# EAGLE design hb100 (EAGLE 6.1)
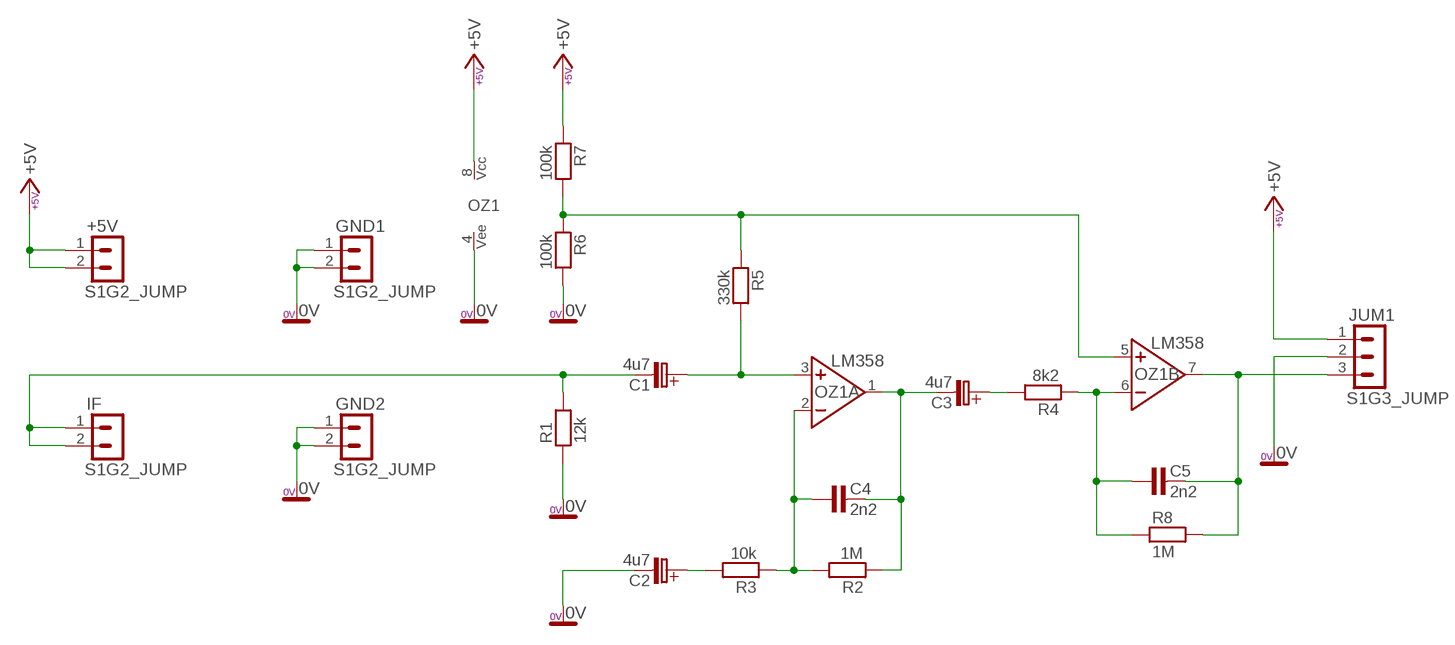
[diagram p0: schematic, sheet 1]

## Parts
+5V  S1G2_JUMP  [S1G2_JUM]
C1  4u7  C-ELEKTROLYT_3,5  [C-EL_3,5]
C2  4u7  C-ELEKTROLYT_3,5  [C-EL_3,5]
C3  4u7  C-ELEKTROLYT_3,5  [C-EL_3,5]
C4  2n2  C-KERAMIK_5  [C-5]
C5  2n2  C-KERAMIK_5  [C-5]
GND1  S1G2_JUMP  [S1G2_JUM]
GND2  S1G2_JUMP  [S1G2_JUM]
IF  S1G2_JUMP  [S1G2_JUM]
JUM1  S1G3_JUMP  [S1G3_JUM]
OZ1  LM358  [DIL8]
R1  12k  R_7,5  [R-7,5]
R2  1M  R_7,5  [R-7,5]
R3  10k  R_7,5  [R-7,5]
R4  8k2  R_7,5  [R-7,5]
R5  330k  R_7,5  [R-7,5]
R6  100k  R_7,5  [R-7,5]
R7  100k  R_7,5  [R-7,5]
R8  1M  R_7,5  [R-7,5]

## Nets
0V: C2.C-(C_EL-) GND1.1 GND1.2 GND2.1 GND2.2 JUM1.2 OZ1.4(NS:VEE) R1.1 R6.2
+5V: +5V.1 +5V.2 JUM1.1 OZ1.8(NS:VCC) R7.1
N$1: C1.C-(C_EL-) IF.1 IF.2 R1.2
N$2: C1.C+(C_EL+) OZ1.3(A:NEIN+) R5.2
N$3: C3.C+(C_EL+) R4.2
N$4: OZ1.5(B:NEIN+) R5.1 R6.1 R7.2
N$5: C3.C-(C_EL-) C4.2 OZ1.1(A:VYSTUP) R2.1
N$6: C5.1 OZ1.6(B:IN-) R4.1 R8.1
N$8: C2.C+(C_EL+) R3.2
N$9: C4.1 OZ1.2(A:IN-) R2.2 R3.1
N$10: C5.2 JUM1.3 OZ1.7(B:VYSTUP) R8.2

## Library data of the parts
+5V GND1 GND2 IF = #PaJa_konektory:S1G2_JUMP: Radove konektory - koliky - 2x
C1-C3 = #PaJa_30:C-ELEKTROLYT: Kondenzator - elektrolyticky
C4 C5 = #PaJa_30:C-KERAMIK: Kondenzator - keramicky
JUM1 = #PaJa_konektory:S1G3_JUMP: Radove konektory - koliky - 3x
OZ1 = #PaJa_30:LM358: OZ - 2x - nizkoprikonovy
R1-R8 = #PaJa_30:R: Rezistor

## Board
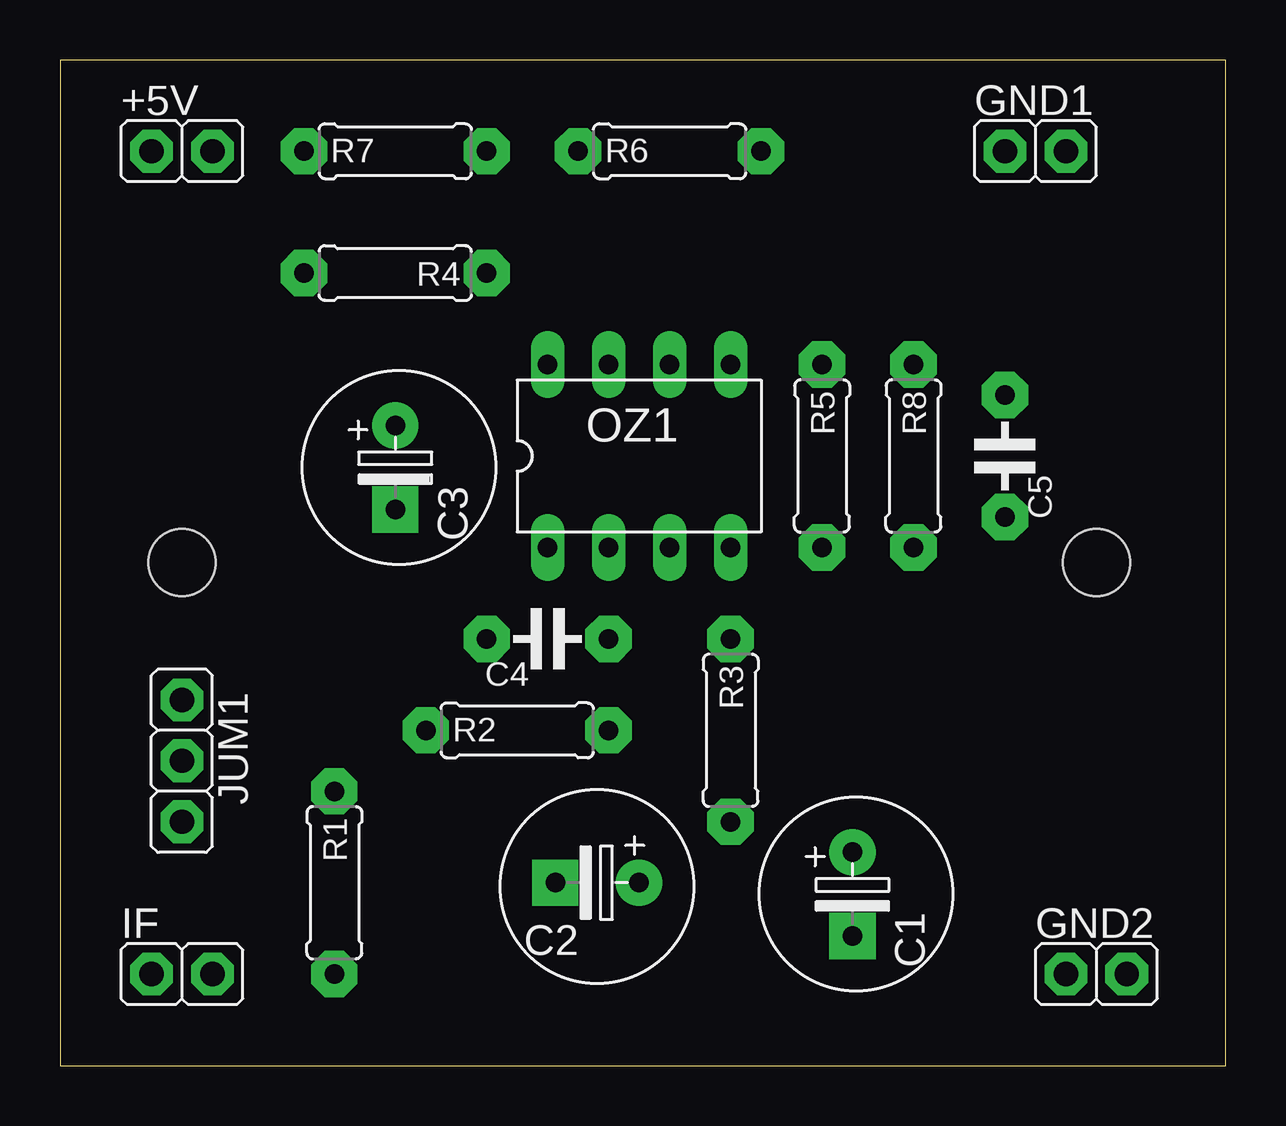
[diagram p1: board, top side]
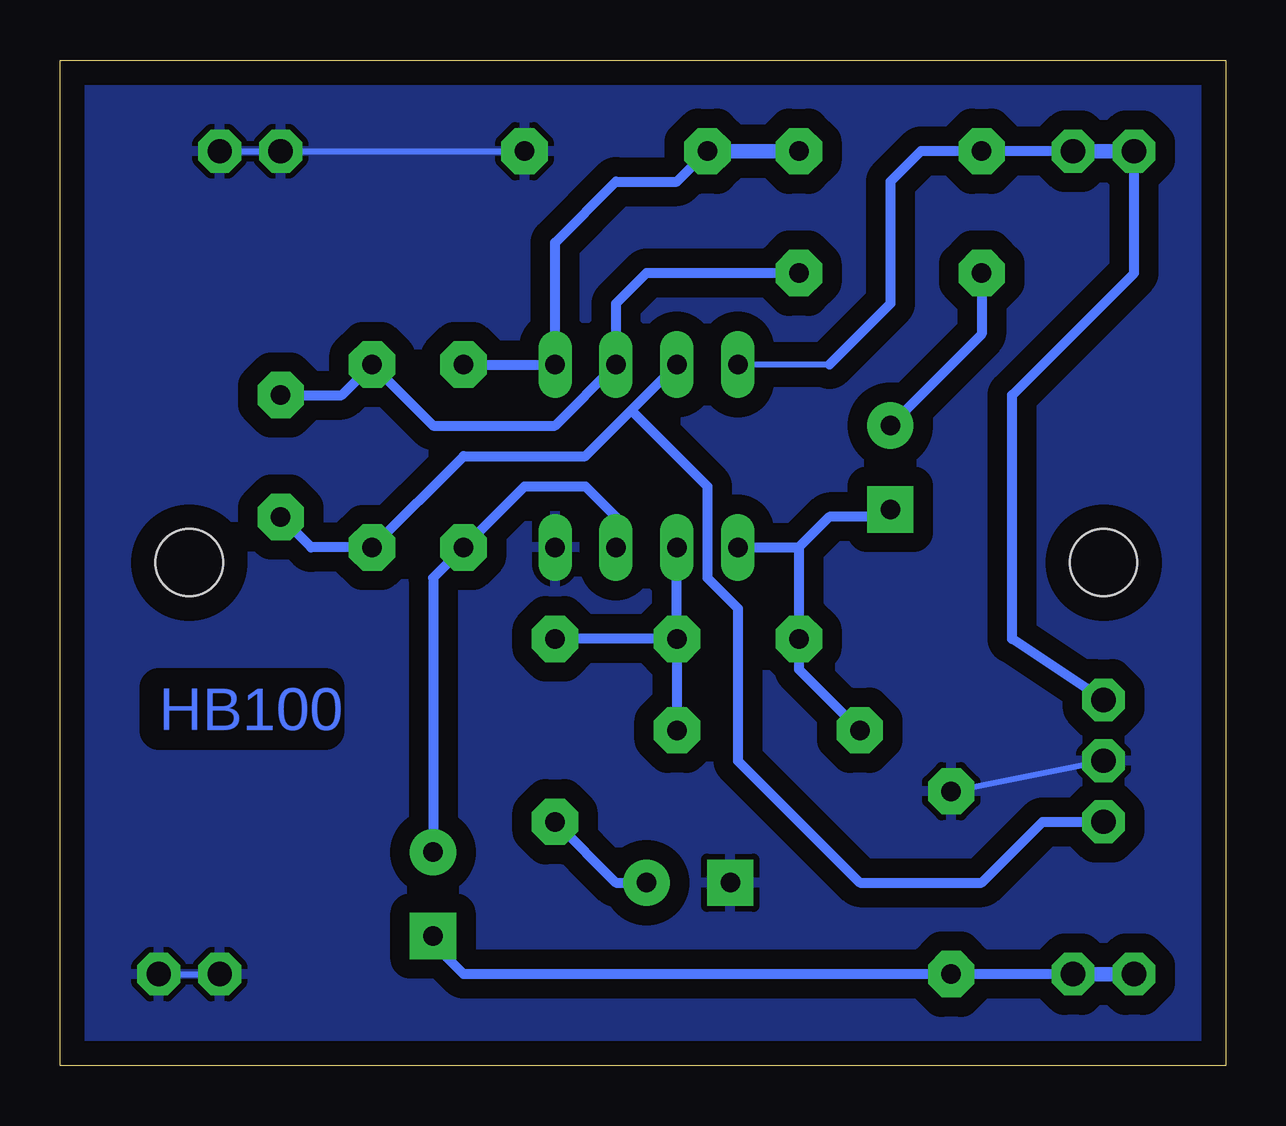
[diagram p2: board, bottom side, seen from below]

Size 48.57 x 41.9 mm. Coordinates in mm from the lower left corner, seen from the top.
Outline: 0,0 48.57,0 48.57,41.9 0,41.9 0,0
Copper layers (1*16): Top 0.035mm / dielectric 1.5mm / Bottom 0.035mm
Design rules: minimum track width 10mil, minimum drill 24mil, track to track 8mil, track to pad 8mil, pad to pad 8mil, via to via 8mil, smd to smd 8mil, copper to edge 40mil, drill to drill 8mil, minimum pad ring 10mil, minimum via ring 8mil, stop-mask expansion 4mil, vias tented up to drill 0mil, thermal gap 10mil
Holes 2.8 mm at 5.08,20.95 43.18,20.95

### Footprints (pad centres in the part's own frame; a part is rotated, then mirrored left to right if it is on the bottom)
S1G2_JUM = drill 1.016 pad 1.778 octagon: 1 -1.27,0; 2 1.27,0
C-EL_3,5 = drill 0.813 pad 1.93: C+ 0,0 | drill 0.813 pad 1.93 square: C- 3.493,0
C-5 = drill 0.813 pad 1.93 octagon: 1 -2.54,0; 2 2.54,0
S1G3_JUM = drill 1.016 pad 1.778 octagon: 1 -2.54,0; 2 0,0; 3 2.54,0
DIL8 = drill 0.813 pad 1.4 long: 1 -3.81,-3.81; 2 -1.27,-3.81; 3 1.27,-3.81; 4 3.81,-3.81; 5 3.81,3.81; 6 1.27,3.81; 7 -1.27,3.81; 8 -3.81,3.81
R-7,5 = drill 0.813 pad 1.93 octagon: 1 -3.81,0; 2 3.81,0

### Placement (x,y rotation side)
+5V  5.08,38.1 0 top
C1  33.02,8.89 270 top
C2  24.13,7.62 180 top
C3  13.97,26.67 270 top
C4  20.32,17.78 180 top
C5  39.37,25.4 270 top
GND1  40.64,38.1 0 top
GND2  43.18,3.81 0 top
IF  5.08,3.81 0 top
JUM1  5.08,12.7 270 top
OZ1  24.13,25.4 0 top
R1  11.43,7.62 270 top
R2  19.05,13.97 0 top
R3  27.94,13.97 270 top
R4  13.97,33.02 180 top
R5  31.75,25.4 270 top
R6  25.4,38.1 0 top
R7  13.97,38.1 0 top
R8  35.56,25.4 270 top

### Tracks (layer width: path | path; a pad name or v marks a point on that pad's centre or on a via)
0V
  Bottom 0.254: R1.1 JUM1.2 | GND2.2 GND2.1 | GND1.2 GND1.1 R6.2
  pour Bottom (isolate 0.813): 0,0 0,41.91 48.26,41.91 48.26,0
+5V
  Bottom 0.254: 16.51,29.21 OZ1.8
  Bottom 0.406: JUM1.1 8.89,17.78 8.89,27.94 3.81,33.02 +5V.1 | +5V.2 R7.1 12.7,38.1 13.97,36.83 13.97,31.75 16.51,29.21
  Bottom 0.61: +5V.1 +5V.2
N$1
  Bottom 0.406: IF.2 R1.2 31.75,3.81 33.02,5.08 C1.C-
  Bottom 0.61: IF.2 IF.1
N$2
  Bottom 0.406: C1.C+ 33.02,20.32 R5.2 29.21,24.13 26.67,24.13 25.4,22.86 OZ1.3
N$3
  Bottom 0.406: C3.C+ 10.16,30.48 R4.2
N$4
  Bottom 0.406: R5.1 OZ1.5 27.94,34.29 25.4,36.83 22.86,36.83 R6.1
  Bottom 0.61: R6.1 R7.2
N$5
  Bottom 0.254: 13.97,22.86 C3.C-
  Bottom 0.406: 13.97,22.86 16.51,22.86 17.78,21.59 | OZ1.1 17.78,21.59 | 17.78,21.59 C4.2 17.78,16.51 R2.1
N$6
  Bottom 0.406: R4.1 24.13,33.02 25.4,31.75 OZ1.6 27.94,26.67 33.02,26.67 R8.1 36.83,27.94 C5.1
N$8
  Bottom 0.406: R3.2 25.4,7.62 C2.C+
N$9
  Bottom 0.406: C4.1 OZ1.2 | C4.1 R2.2 | C4.1 R3.1
N$10
  Bottom 0.406: 24.77,27.3 26.67,25.4 31.75,25.4 R8.2 38.1,21.59 C5.2 | 24.77,27.3 OZ1.7 | JUM1.3 7.62,10.16 10.16,7.62 15.24,7.62 20.32,12.7 20.32,19.05 21.59,20.32 21.59,24.13 24.77,27.3

### Text on the board
Bottom: HB100